# Altium schematic sheet ServoLevelShifter.SchDoc: Servo Signal Level Shifter Module
size A; DrawnBy: J. Sullivan; Organization: ORGANIZATION; Address1: ADDRESS 1; Address2: ADDRESS 2; Address3: ADDRESS 3; Address4: ADDRESS 4; Revision: -; SheetNumber: 6; SheetTotal: 9; ENG_APP_DATE: --/--/--; DSN_APP_DATE: --/--/--; CHK_APP_DATE: --/--/--
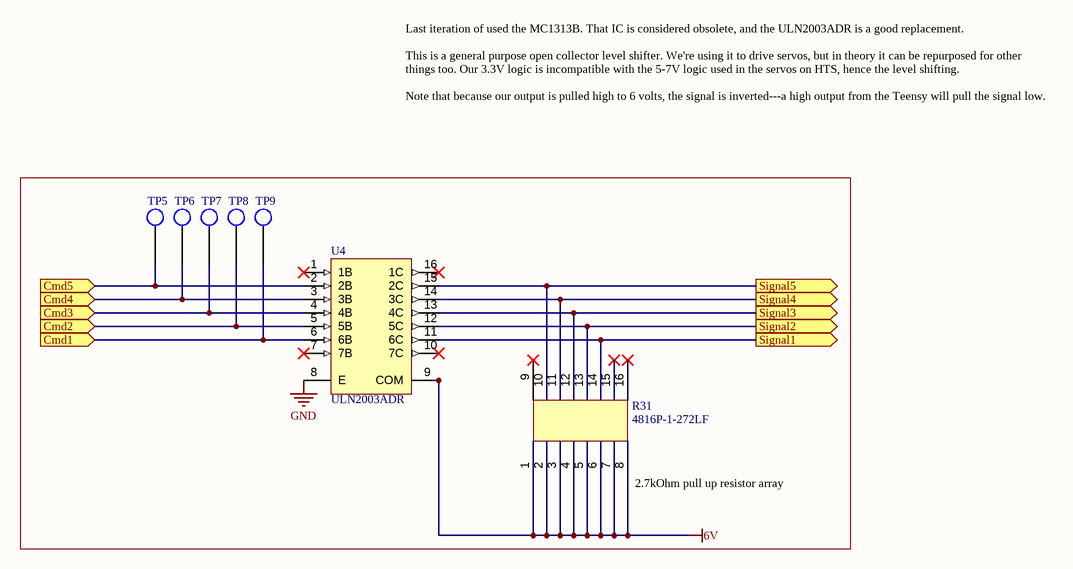
[diagram p0: ServoLevelShifter.SchDoc]

## Parts
R31  4816P-1-272LF  [SOIC16_N]
TP5  BURPG_TestPoint1  [BURPG_TestPoint1]  (value not drawn)  (no BOM)
TP6  BURPG_TestPoint1  [BURPG_TestPoint1]  (value not drawn)  (no BOM)
TP7  BURPG_TestPoint1  [BURPG_TestPoint1]  (value not drawn)  (no BOM)
TP8  BURPG_TestPoint1  [BURPG_TestPoint1]  (value not drawn)  (no BOM)
TP9  BURPG_TestPoint1  [BURPG_TestPoint1]  (value not drawn)  (no BOM)
U4  ULN2003ADR  [D0016A_M]

## Ports
Cmd1 (in), Cmd2 (in), Cmd3 (in), Cmd4 (in), Cmd5 (in), Signal1 (out), Signal2 (out), Signal3 (out), Signal4 (out), Signal5 (out)

## Nets
6V: R31.1 R31.2 R31.3 R31.4 R31.5 R31.6 R31.7 R31.8 U4.9(COM)
GND: U4.8(E)
Cmd1: TP9.1 U4.6(6B) ; port Cmd1
Cmd2: TP8.1 U4.5(5B) ; port Cmd2
Cmd3: TP7.1 U4.4(4B) ; port Cmd3
Cmd4: TP6.1 U4.3(3B) ; port Cmd4
Cmd5: TP5.1 U4.2(2B) ; port Cmd5
Signal1: R31.14 U4.11(6C) ; port Signal1
Signal2: R31.13 U4.12(5C) ; port Signal2
Signal3: R31.12 U4.13(4C) ; port Signal3
Signal4: R31.11 U4.14(3C) ; port Signal4
Signal5: R31.10 U4.15(2C) ; port Signal5

Not connected (* = marked no-connect by the designer): R31 9 15* 16*; U4 1(1B)* 7(7B)* 10(7C)* 16(1C)*

## Notes on the sheet
- Last iteration of used the MC1313B. That IC is considered obsolete, and the ULN2003ADR is a good replacement.
  This is a general purpose open collector level shifter. We're using it to drive servos, but in theory it can be repurposed for other things too. Our 3.3V logic is incompatible with the 5-7V logic used in the servos on HTS, hence the level shifting.
  Note that because our output is pulled high to 6 volts, the signal is inverted---a high output from the Teensy will pull the signal low.
- (near R31) 2.7kOhm pull up resistor array
- PROJECT
- Drawn:
- Approved:
- APPROVALS
- DATE
- SCALE:
- SIZE
- A
- Title
- FILE NAME
- SHEET
- OF
- REV

## Library data of the parts
U4 = CMP-2000-04953-1: High-Voltage, High-Current Darlington Transistor Array, 0.5 A, 50 V, -20 to 70 degC, 16-Pin SOIC (D), Green (RoHS & no Sb/Br), Tape and Reel; Manufacturer: TexasInstruments; Peak DC Collector Current: 0.5A; Package Version: 4040047-6/M, 06/2011; Maximum Collector Emitter Voltage: 50V; Configuration: Array7; Maximum Collector Emitter Saturation Voltage: 1.1@100mA; Rad Hard: No; Packaging: Tape&Reel; Datasheet URL: http://www.ti.com/general/docs/lit/getliterature.tsp?genericPartNumber=uln2003a&fileType=pdf; Package Reference: D16; Category: DarlingtonBJT; Datasheet Version: Rev. O, 01/2016; Manufacturer URL: http://www.ti.com/; Type: NPN; Package Description: 16-Pin Plastic Small Outline, Body 9.9 x 3.9 mm, Pitch 1.27 mm; Mounting: SurfaceMount; Package: 16SOIC; Package URL: http://www.ti.com/lit/ml/mpds178g/mpds178g.pdf